# EAGLE design Ruby (EAGLE 7.7.0)
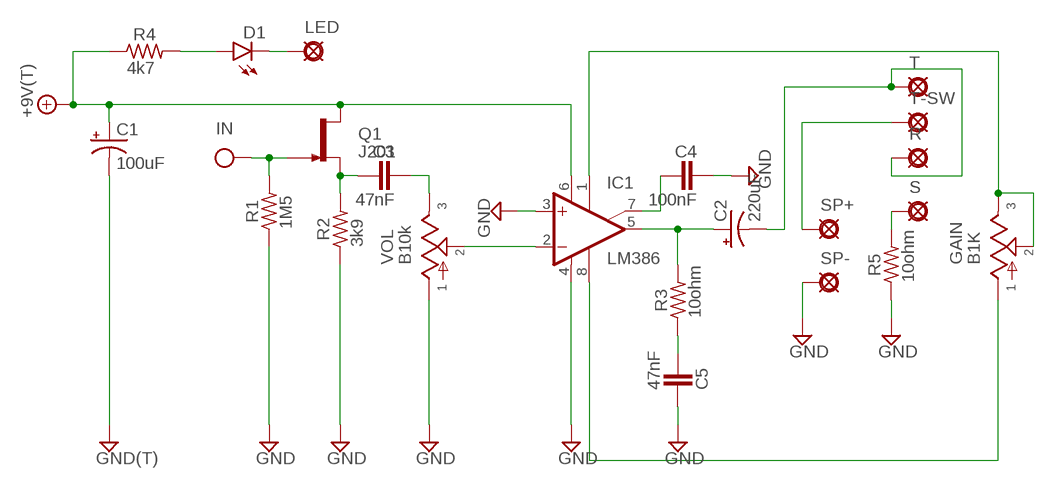
[diagram p0: schematic, sheet 1]

## Parts
+9V  +9V(T)  [SQUARE]
C1  100uF  0631  [063_025]
C2  220uF  0801  [080_035_1]
C3  47nF  072X0352  [072X035]
C4  100nF  072X0352  [072X035]
C5  47nF  072X0352  [072X035]
D1  LED3MM  [LED3MM]
GAIN  B1K  POT16MM  [16MM]
GND  GND(T)  [SQUARE]
IC1  LM386  [DIL08]
IN  IN(T)  [SQUARE]
LED  PAD  [SQUARE]
Q1  J201  [TO92-]
R  PAD  [SQUARE]
R1  1M5  6MM.3  [R0207/3]
R2  3k9  6MM.3  [R0207/3]
R3  10ohm  6MM.3  [R0207/3]
R4  4k7  6MM.3  [R0207/3]
R5  10ohm  6MM.3  [R0207/3]
S  PADO  [ROUND]
SP+  PAD  [SQUARE]
SP-  PADO  [ROUND]
T  PAD  [SQUARE]
T-SW  PAD  [SQUARE]
VOL  B10k  POT16MM  [16MM]

## Nets
+9V: +9V.1(+9V) C1.+ IC1.6(V+) Q1.3(D) R4.1
GND: C1.- C4.2 C5.2 GND.1(GND) IC1.3(+IN) IC1.4(V-) R1.1 R2.1 R5.1 SP-.1(PAD) VOL.1
IN: IN.1(IN) Q1.1(G) R1.2
N$1: D1.A R4.2
N$2: D1.K(C) LED.1(PAD)
N$3: C3.1 Q1.2(S) R2.2
N$4: C3.2 VOL.3
N$5: IC1.2(-IN) VOL.2
N$6: C4.1 IC1.7(BYPASS)
N$7: C2.+ IC1.5(OUT) R3.2
N$8: C5.1 R3.1
N$9: R5.2 S.1(PAD)
N$10: SP+.1(PAD) T-SW.1(PAD)
N$11: C2.- R.1(PAD) T.1(PAD)
N$12: GAIN.2 GAIN.3 IC1.1(GAIN1)
N$13: GAIN.1 IC1.8(GAIN2)

## Library data of the parts
+9V = mb_supply:+9V(T): +9V Voltage Supply use this to hook up +9v throughout a schematic instead of running wire automatically labels the net "+9v" adds a hookup pad to the circuit board
C1 = mb_caps-electro:063: 33 - 220uF Xicon values at Mouser.com 10V: 220uF; 16V: 100uF; 25V: 100uF; 50V: 33uF
C2 = mb_caps-electro:080: 47 - 470uF Xicon values at Mouser.com 10V: 330, 470uF; 16V: 220, 330uF; 25V: 220uF; 50V: 47, 100uF
C3-C5 = mb_caps-box:072X035: 0.15 - 1.0uF; WIMA MKP2 63, 100V: 0.047uF; MKS2 50V: 0.68 - 1.0uF; 63V: 0.33 - 0.47uF; 100V: 0.15 - 0.22uF;
D1 = mb_diodes:LED
GAIN VOL = mb_pots:POT: Potentiometers the arrow indicates the clockwise motion of th wiper (lug 2) fully counter clockwise there is no resistance between lugs 1 and 2 fully clockwise the resistance between lugs 1 and 2 is the value of the pot
GND = mb_supply:GND(T): Ground use this to hook up ground (GND) throughout a schematic instead of running wire automatically labels the net "GND" adds a hookup pad to the circuit board (you can use several)
IC1 = mb_ics:LM386: LM386 - Low Voltage Audio Power Amplifier
IN = mb_supply:IN(T): Input obsolete: use Pad instead and label net shematic input label with circuit board terminal/pad generally used only once on a schematic (because this device labels the net "IN" in the same way as a voltage supply or ground net)
LED R S SP+ SP- T T-SW = mb_supply:PAD: PAD use this package for pads with any purpose, including input, output, send or return various pad shapes: round, square, octogonal, long, and long offset
Q1 = mb_trans:J201: N-channel JFET
R1-R5 = mb_resistors:6MM: 6mm Resistors Leads spaced 1-6 holes apart for 0.1" perfboard. Suitable for 1/4 watt resistors.

## Board
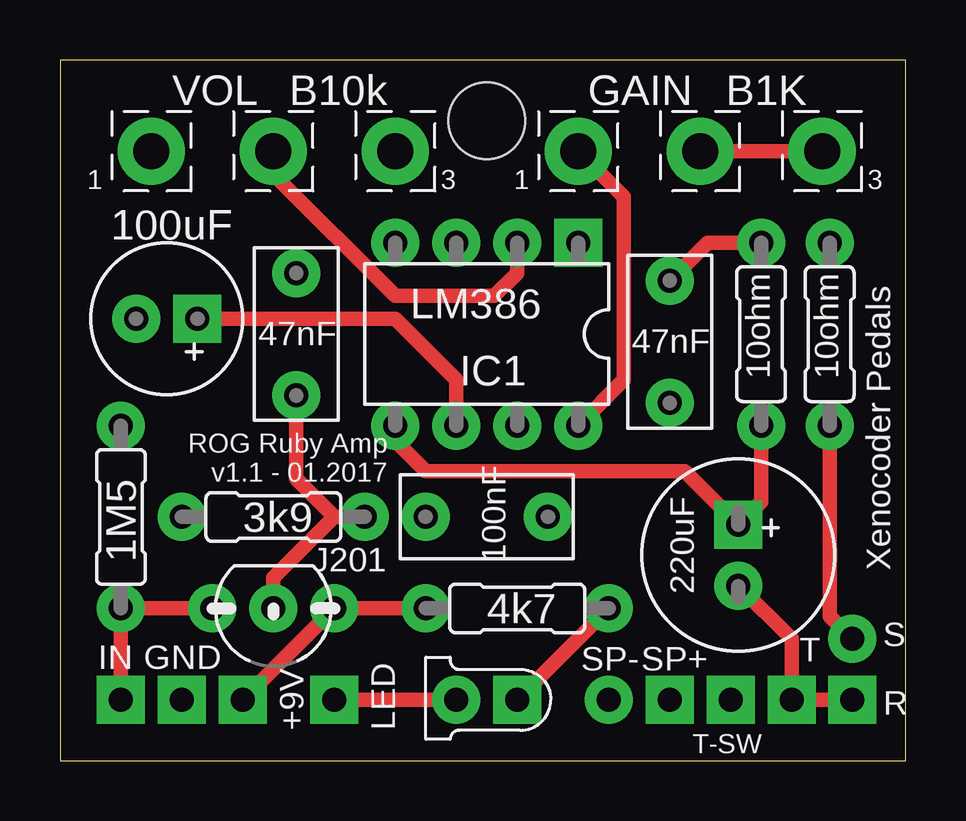
[diagram p1: board, top side]
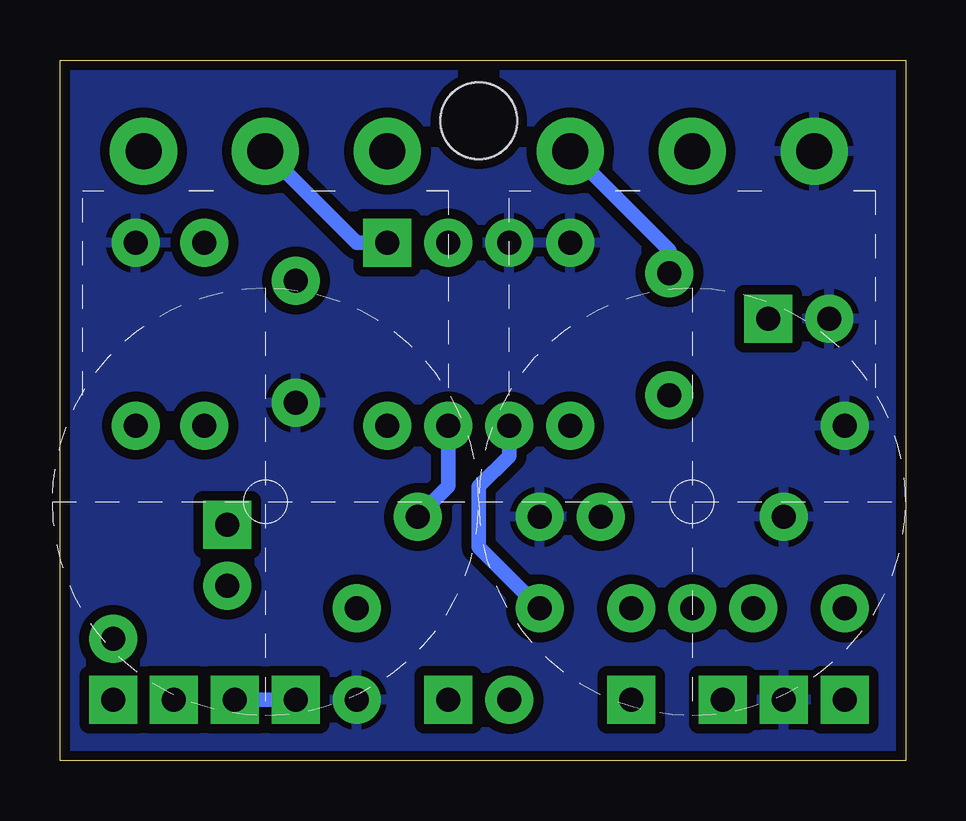
[diagram p2: board, bottom side, seen from below]

Size 35.23 x 29.2 mm. Coordinates in mm from the lower left corner, seen from the top.
Outline: 0,0 35.23,0 35.23,29.2 0,29.2 0,0
Copper layers (1*16): Top 0.0356mm / dielectric 1.5011mm / Bottom 0.0356mm
Design rules "oshpark-2layer": minimum track width 6mil, minimum drill 13mil, track to track 6mil, track to pad 6mil, pad to pad 6mil, via to via 6mil, smd to smd 6mil, copper to edge 15mil, drill to drill 6mil, minimum pad ring 7mil, minimum via ring 7mil, stop-mask expansion 2.5mil, vias tented up to drill 0mil, thermal gap 10mil
Holes 3.2 mm at 17.78,26.67

### Footprints (pad centres in the part's own frame; a part is rotated, then mirrored left to right if it is on the bottom)
SQUARE = drill 1 pad 2 square: 1 0,0
063_025 = drill 1 pad 2 square: + -1.27,0 | drill 1 pad 2: - 1.27,0
080_035_1 = drill 1 pad 2 square: + -1.27,0 | drill 1 pad 2: - 1.27,0
072X035 = drill 1 pad 2: 1 -2.54,0; 2 2.54,0
LED3MM = drill 1 pad 2 square: A -1.27,0 | drill 1 pad 2: K 1.27,0
16MM = drill 1.5 pad 2.794: 1 5.08,0; 2 0,0; 3 -5.08,0
DIL08 = drill 1 pad 2 square: 1 -3.81,-3.81 | drill 1 pad 2: 2 -1.27,-3.81; 3 1.27,-3.81; 4 3.81,-3.81; 5 3.81,3.81; 6 1.27,3.81; 7 -1.27,3.81; 8 -3.81,3.81
TO92- = drill 1 pad 2: 1 2.54,0; 2 0,0; 3 -2.54,0
R0207/3 = drill 1 pad 2: 1 -3.81,0; 2 3.81,0
ROUND = drill 1 pad 2: 1 0,0

### Placement (x,y rotation side)
+9V  7.62,2.54 0 top
C1  4.45,18.41 180 top
C2  28.26,8.57 270 top
C3  9.84,17.78 90 top
C4  17.78,10.16 180 top
C5  25.4,17.46 270 top
D1  17.78,2.54 180 top
GAIN  26.67,25.4 180 top
GND  5.08,2.54 0 top
IC1  17.78,17.78 180 top
IN  2.54,2.54 0 top
LED  11.43,2.54 0 top
Q1  8.89,6.35 180 top
R  33.02,2.54 0 top
R1  2.54,10.16 270 top
R2  8.89,10.16 0 top
R3  29.21,17.78 270 top
R4  19.05,6.35 0 top
R5  32.07,17.78 270 top
S  33.02,5.08 0 top
SP+  25.4,2.54 0 top
SP-  22.86,2.54 0 top
T  30.48,2.54 0 top
T-SW  27.94,2.54 0 top
VOL  8.89,25.4 180 top

### Tracks (layer width: path | path; a pad name or v marks a point on that pad's centre or on a via)
+9V
  Top 0.61: +9V.1 Q1.3 R4.1 | IC1.6 16.51,15.88 13.97,18.41 C1.+
  Bottom 0.61: R4.1 17.78,8.89 17.78,11.43 16.51,12.7 IC1.6
GND
  pour Bottom (isolate 0.406): 0,29.21 35.56,29.21 35.56,0 0,0
IN
  Top 0.61: IN.1 R1.2 Q1.1
N$1
  Top 0.61: D1.A R4.2
N$2
  Top 0.61: D1.K LED.1
N$3
  Top 0.61: R2.2 11.43,10.16 | 11.43,10.16 8.89,7.62 Q1.2 | C3.1 9.84,11.75 11.43,10.16
N$4
  Bottom 0.61: C3.2 9.84,21.27 VOL.3
N$5
  Top 0.61: IC1.2 19.05,20.32 18.1,19.37 13.97,19.37 8.89,24.45 VOL.2
N$6
  Bottom 0.61: C4.1 19.05,11.43 IC1.7
N$7
  Top 0.61: R3.2 29.21,10.79 C2.+ 26.04,12.06 15.24,12.06 13.97,13.34 IC1.5
N$8
  Top 0.61: C5.1 26.99,21.59 R3.1
N$9
  Top 0.61: S.1 32.07,6.03 R5.2
N$10
  Bottom 0.61: SP+.1 T-SW.1
N$11
  Top 0.61: C2.- 30.48,5.08 T.1 R.1
N$12
  Top 0.61: GAIN.3 GAIN.2
  Bottom 0.61: IC1.1 22.86,21.59 GAIN.2
N$13
  Top 0.61: GAIN.1 23.5,23.5 23.5,15.88 IC1.8

### Text on the board
tNames: ROG Ruby Amp / v1.1 - 01.2017 | Xenocoder Pedals